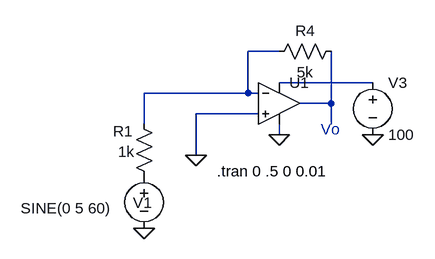
[diagram p0: schematic op_amp_test.asc]
op_amp_test.asc, the LTspice schematic file:
Version 4
SHEET 1 880 680
WIRE -32 -224 -80 -224
WIRE 112 -176 -32 -176
WIRE -80 -160 -80 -224
WIRE -80 -160 -240 -160
WIRE -64 -160 -80 -160
WIRE 48 -144 48 -224
WIRE 48 -144 0 -144
WIRE -64 -128 -160 -128
WIRE -240 -112 -240 -160
WIRE 48 -112 48 -144
WIRE -32 -96 -32 -112
WIRE -160 -64 -160 -128
FLAG -240 48 0
FLAG -160 -64 0
FLAG -32 -96 0
FLAG 112 -96 0
SYMBOL res -256 -128 R0
WINDOW 0 -32 27 Left 2
WINDOW 3 -24 58 Left 2
SYMATTR InstName R1
SYMATTR Value 1k
SYMBOL res 64 -240 R90
WINDOW 0 0 56 VBottom 2
WINDOW 3 32 56 VTop 2
SYMATTR InstName R4
SYMATTR Value 5k
SYMBOL voltage -240 -48 R0
WINDOW 0 -17 57 Left 2
WINDOW 3 -190 65 Left 2
WINDOW 123 0 0 Left 0
WINDOW 39 0 0 Left 0
SYMATTR InstName V1
SYMATTR Value SINE(0 5 60)
SYMBOL voltage 112 -192 R0
WINDOW 123 0 0 Left 0
WINDOW 39 0 0 Left 0
SYMATTR InstName V3
SYMATTR Value 100
SYMBOL OpAmps\\UniversalOpAmp2 -32 -144 R0
SYMATTR InstName U1
TEXT -128 -40 Left 2 !.tran 0 .5 0 0.01
TEXT 32 -104 Left 2 ;Vo

The netlist it stands for:
* op_amp_test.asc
R1 N001 P001 1k
R4 N003 N001 5k
V1 P001 0 SINE(0 5 60)
V3 N002 0 100
XU1 0 N001 N002 0 N003 level2 Avol=1Meg GBW=10Meg Slew=10Meg Ilimit=25m Rail=0 Vos=0 En=0 Enk=0 In=0 Ink=0 Rin=500Meg  ; pins In+ In- V+ V- OUT
.tran 0 .5 0 0.01
* Vo
.lib UniversalOpAmp2.lib
.backanno
.end